# Altium schematic sheet MCU.SchDoc: QUTMS Shutdown V2.1 - MCU
size A4; Author: Jonn Dillon; Organization: QUT Motorsport; Address1: O-120; Address2: O Block; Address3: QUT Gardens Point; Address4: Brisbane, 4000; DocumentNumber: 2; Revision: 2; SheetNumber: 2; SheetTotal: 4
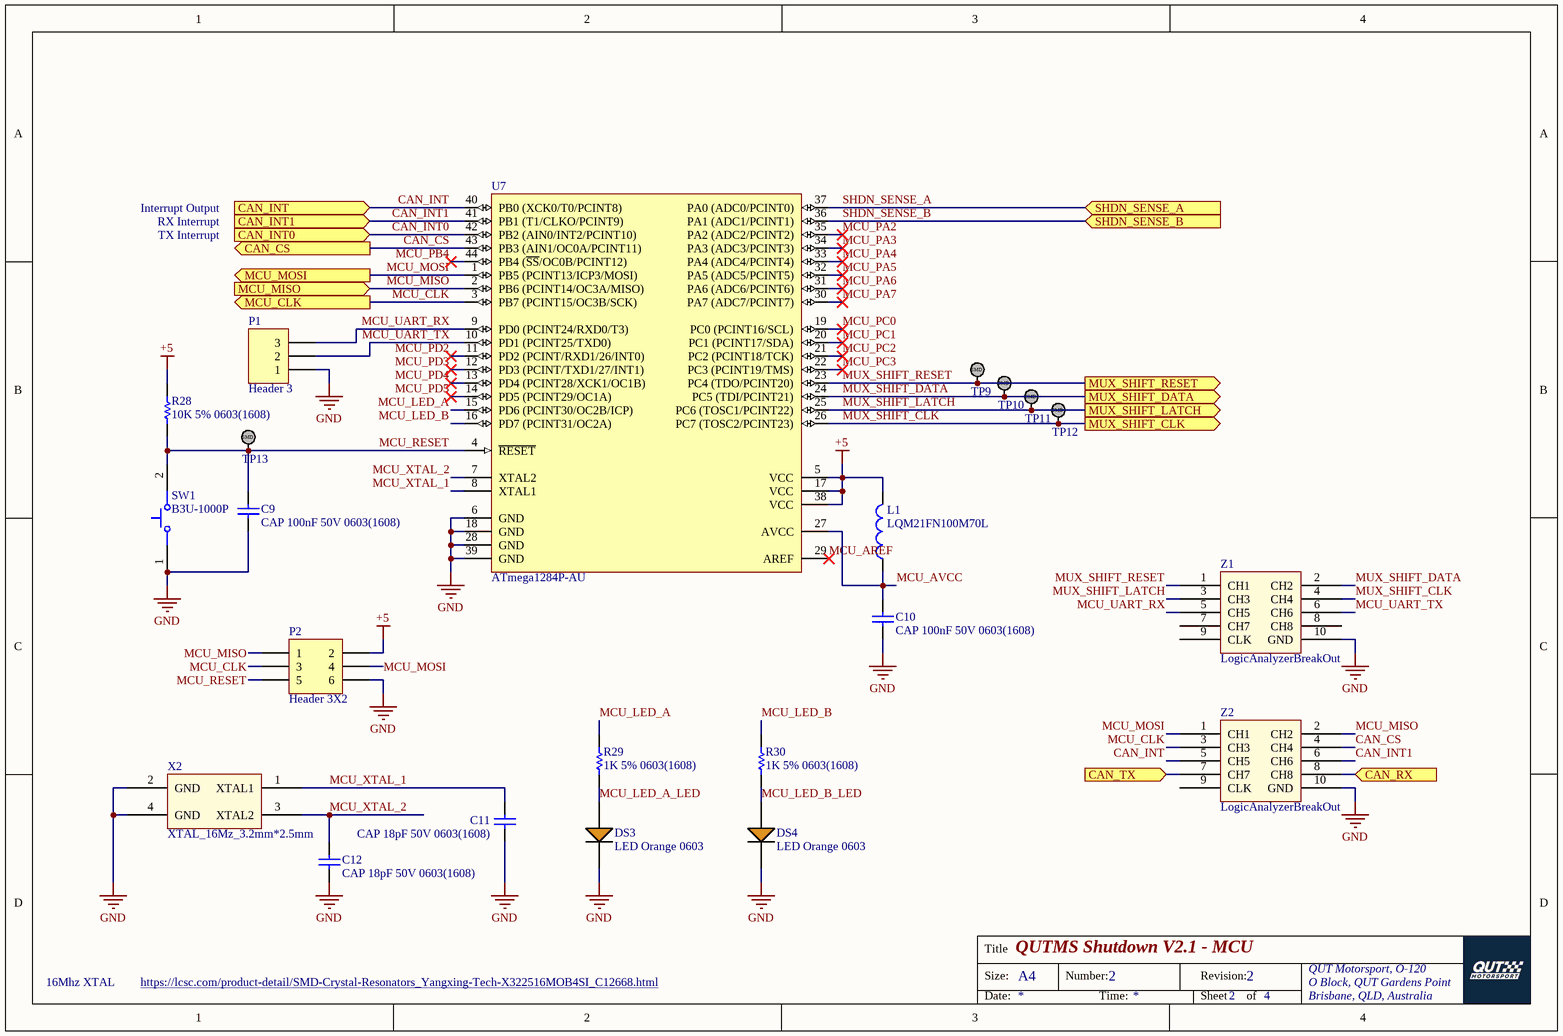
[diagram p0: MCU.SchDoc]

## Parts
C9  CAP 100nF 50V 0603(1608)  [CAPC0603(1608)100_L]
C10  CAP 100nF 50V 0603(1608)  [CAPC0603(1608)100_L]
C11  CAP 18pF 50V 0603(1608)  [CAPC0603(1608)100_L]
C12  CAP 18pF 50V 0603(1608)  [CAPC0603(1608)100_L]
DS3  LED Orange 0603  [LED ORANGE 0603]
DS4  LED Orange 0603  [LED ORANGE 0603]
L1  LQM21FN100M70L  [MURA-IND0805_L]
P1  Header 3  [HDR1X3]
P2  Header 3X2  [HDR2X3]
R28  10K 5% 0603(1608)  [RESC0603(1608)_N]
R29  1K 5% 0603(1608)  [RESC0603(1608)_L]
R30  1K 5% 0603(1608)  [RESC0603(1608)_L]
SW1  B3U-1000P  [OMRON-B3U-1000_V]
TP9  TestPoint_SMD  [TestPointSMD]  (value not drawn)
TP10  TestPoint_SMD  [TestPointSMD]  (value not drawn)
TP11  TestPoint_SMD  [TestPointSMD]  (value not drawn)
TP12  TestPoint_SMD  [TestPointSMD]  (value not drawn)
TP13  TestPoint_SMD  [TestPointSMD]  (value not drawn)
U7  ATmega1284P-AU  [44A_N]
X2  XTAL_16Mz_3.2mm*2.5mm  [3.2mm*2.5mm]
Z1  LogicAnalyzerBreakOut  [LogicAnalyzer]
Z2  LogicAnalyzerBreakOut  [LogicAnalyzer]

## Ports
CAN_CS (out), CAN_INT0 (in), CAN_INT1 (in), CAN_INT (in), CAN_RX (in), CAN_TX (in), MCU_CLK (out), MCU_MISO (in), MCU_MOSI (out), MUX_SHIFT_CLK (out), MUX_SHIFT_DATA (out), MUX_SHIFT_LATCH (out), MUX_SHIFT_RESET (out), SHDN_SENSE_A (in), SHDN_SENSE_B (in)

## Nets
+5: L1.2 P2.2 R28.2 U7.5(VCC) U7.17(VCC) U7.38(VCC)
GND: C9.2 C10.2 C11.1 C12.1 DS3.2(C) DS4.2(C) P1.1 P2.6 SW1.1 U7.6(GND) U7.18(GND) U7.28(GND) U7.39(GND) X2.2(GND) X2.4(GND) Z1.10(GND) Z2.10(GND)
CAN_CS: U7.43(PB3_(AIN1/OC0A/PCINT11)) Z2.4(CH4) ; port CAN_CS
CAN_INT: U7.40(PB0_(XCK0/T0/PCINT8)) Z2.5(CH5) ; port CAN_INT
CAN_INT0: U7.42(PB2_(AIN0/INT2/PCINT10)) ; port CAN_INT0
CAN_INT1: U7.41(PB1_(T1/CLKO/PCINT9)) Z2.6(CH6) ; port CAN_INT1
CAN_RX: Z2.8(CH8) ; port CAN_RX
CAN_TX: Z2.7(CH7) ; port CAN_TX
MCU_AREF: U7.29(AREF)
MCU_AVCC: C10.1 L1.1 U7.27(AVCC)
MCU_CLK: P2.3 U7.3(PB7_(PCINT15/OC3B/SCK)) Z2.3(CH3) ; port MCU_CLK
MCU_LED_A: R29.2 U7.15(PD6_(PCINT30/OC2B/ICP))
MCU_LED_A_LED: DS3.1(A) R29.1
MCU_LED_B: R30.2 U7.16(PD7_(PCINT31/OC2A))
MCU_LED_B_LED: DS4.1(A) R30.1
MCU_MISO: P2.1 U7.2(PB6_(PCINT14/OC3A/MISO)) Z2.2(CH2) ; port MCU_MISO
MCU_MOSI: P2.4 U7.1(PB5_(PCINT13/ICP3/MOSI)) Z2.1(CH1) ; port MCU_MOSI
MCU_PA2: U7.35(PA2_(ADC2/PCINT2))
MCU_PA3: U7.34(PA3_(ADC3/PCINT3))
MCU_PA4: U7.33(PA4_(ADC4/PCINT4))
MCU_PA5: U7.32(PA5_(ADC5/PCINT5))
MCU_PA6: U7.31(PA6_(ADC6/PCINT6))
MCU_PA7: U7.30(PA7_(ADC7/PCINT7))
MCU_PB4: U7.44(PB4_(~{SS}/OC0B/PCINT12))
MCU_PC0: U7.19(PC0_(PCINT16/SCL))
MCU_PC1: U7.20(PC1_(PCINT17/SDA))
MCU_PC2: U7.21(PC2_(PCINT18/TCK))
MCU_PC3: U7.22(PC3_(PCINT19/TMS))
MCU_PD2: U7.11(PD2_(PCINT/RXD1/26/INT0))
MCU_PD3: U7.12(PD3_(PCINT/TXD1/27/INT1))
MCU_PD4: U7.13(PD4_(PCINT28/XCK1/OC1B))
MCU_PD5: U7.14(PD5_(PCINT29/OC1A))
MCU_RESET: C9.1 P2.5 R28.1 SW1.2 TP13.1 U7.4(~{RESET})
MCU_UART_RX: P1.3 U7.9(PD0_(PCINT24/RXD0/T3)) Z1.5(CH5)
MCU_UART_TX: P1.2 U7.10(PD1_(PCINT25/TXD0)) Z1.6(CH6)
MCU_XTAL_1: C11.2 U7.8(XTAL1) X2.1(XTAL1)
MCU_XTAL_2: C12.2 U7.7(XTAL2) X2.3(XTAL2)
MUX_SHIFT_CLK: TP12.1 U7.26(PC7_(TOSC2/PCINT23)) Z1.4(CH4) ; port MUX_SHIFT_CLK
MUX_SHIFT_DATA: TP10.1 U7.24(PC5_(TDI/PCINT21)) Z1.2(CH2) ; port MUX_SHIFT_DATA
MUX_SHIFT_LATCH: TP11.1 U7.25(PC6_(TOSC1/PCINT22)) Z1.3(CH3) ; port MUX_SHIFT_LATCH
MUX_SHIFT_RESET: TP9.1 U7.23(PC4_(TDO/PCINT20)) Z1.1(CH1) ; port MUX_SHIFT_RESET
SHDN_SENSE_A: U7.37(PA0_(ADC0/PCINT0)) ; port SHDN_SENSE_A
SHDN_SENSE_B: U7.36(PA1_(ADC1/PCINT1)) ; port SHDN_SENSE_B

Not connected (* = marked no-connect by the designer): Z1 7(CH7) 8(CH8) 9(CLK); Z2 9(CLK)

## Notes on the sheet
- TX Interrupt
- RX Interrupt
- Interrupt Output
- 16Mhz XTAL
- https://lcsc.com/product-detail/SMD-Crystal-Resonators_Yangxing-Tech-X322516MOB4SI_C12668.html
- Title
- Size:
- A4
- Number:
- Revision:
- QUT Motorsport, O-120
- O Block, QUT Gardens Point
- Date:
- Time:
- Sheet
- of
- Brisbane, QLD, Australia
- (in symbol TestPoint_SMD) SMD

## Library data of the parts
C9 C10 = CMP-1035-02591-1: CAP 100nF 50V ±5% 0603 (1608 Metric) Thickness 1mm SMD; Tolerance: Â±5%; Case-Metric: 1608; Case-EIA: 0603; Rated Voltage: 50 V; Max Thickness: 1 mm; Technology: SMT; Value: 100nF
C11 C12 = CMP-1035-00748-1: CAP 18pF 50V ±1% 0603 (1608 Metric) Thickness 1mm SMD; Case-EIA: 0603; Case-Metric: 1608; Tolerance: Â±1%; Max Thickness: 1 mm; Value: 18pF; Rated Voltage: 50 V; Technology: SMT
L1 = CMP-2000-06587-1: Fixed Inductor, 10 uH, +/-20%, -55 to 125 degC, 2-Pin SMD (0805), RoHS, Tape and Reel; Manufacturer: Murata; Tolerance (%): 20%; DC Resistance: 0.6; Inductance-Nom: 10H; Rated Current-Max: 100mA; Package Reference: IND0805; Case Size/Dimension: 0805; Manufacturer URL: http://www.murata.com/; Package Description: 2-Pin Surface Mount Device, Body 2 x 1.25 mm; Datasheet URL: http://psearch.en.murata.com/inductor/product/LQM21FN100M70%23.pdf; Mounting Technology: SurfaceMount; Datasheet Version: 05/2016
P1 = Header 3: Header, 3-Pin; LatestRevisionDate: 17-Jul-2002; LatestRevisionNote: Re-released for DXP Platform.; Publisher: Altium Limited
P2 = Header 3X2: Header, 3-Pin, Dual row; LatestRevisionDate: 17-Jul-2002; LatestRevisionNote: Re-released for DXP Platform.; Publisher: Altium Limited
R28 = CMP-1012-00098-1: 10K 0.1W 5% 0603 (1608 Metric)  SMD; Case-EIA: 0603; Value: 10000.00 Ohm; Case-Metric: 1608; Technology: SMT; Tolerance: 5 %; Power: 0.1 W
R29 R30 = CMP-1012-00074-1: 1K 0.1W 5% 0603 (1608 Metric)  SMD; Case-EIA: 0603; Case-Metric: 1608; Value: 1000.00 Ohm; Technology: SMT; Tolerance: 5 %; Power: 0.1 W
SW1 = CMP-2100-03586-1: Ultra-Small Tactile Switch, 0.05 A, 12 V, -25 to 70 degC, 2-Pin SMD, RoHS, Tape and Reel; Manufacturer: Omron Electronic Components; Operating Force: 1.5N; Current Rating: 50mA; Voltage Rating (DC): 12V; Electrical Life: 200000Cycles; Actuator Length: 0.4mm; Insulation Resistance: 100MOhm; Switch Travel: 0.15mm; Throw Configuration: SPST; Illumination Type: Illuminated; Width: 3mm; Weight: 0.022g; Datasheet Version: 42005.0; Datasheet URL: http://www.omron.com/ecb/products/pdf/en-b3u.pdf; Height: 1.2mm; Package Quantity: 1; REACH SVHC: Unknown; Contact Current Rating: 50mA; Contact Material: Silver; Max Current Rating: 50mA; Package Reference: B3U-1000; Termination: SMD/SMT; Packaging: TapeandReel; Manufacturer URL: http://www.omron.com/; RoHSCompliant: true; Mount: SurfaceMount; Length: 4mm; Min Operating Temperature: -25degC; Depth: 2.5mm; Lead Free: LeadFree; Case/Package: SMD/SMT; Package Description: 2-Pin Surface Mount Device, Body 3 x 2.5 mm; Max Operating Temperature: 70degC; Orientation: Straight
U7 = CMP-0095-00577-1: 8-bit AVR Microcontroller, 128KB Flash, 4KB EEPROM, 16KB SRAM, 44-pin TQFP, Industrial Grade (-40°C to 85°C); PackageReference: 44A; Code_JEDEC: MS-026-ACB; ComponentLink3Description: ATmega164A/164PA/324A/324PA/644A/644PA/1284/1284P Summary; DatasheetVersion: revC, Jun-2011; PackageDescription: 44-Pin Plastic Thin Profile Quad Flat Pack, 10 x 10 x 1.0 mm Body, 0.8 mm Pitch (TQFP); ComponentLink3URL: http://www.atmel.com/dyn/resources/prod_documents/8272S.pdf; ComponentLink1URL: http://www.atmel.com/; ComponentLink1Description: Manufacturer URL; ComponentLink2Description: ATmega164A/164PA/324A/324PA/644A/644PA/1284/1284P Datasheet; ComponentLink2URL: http://www.atmel.com/dyn/resources/prod_documents/doc8272.pdf; PackageVersion: revC, Oct-2010
Z1 Z2 = LogicAnalyer
  Z1: ComponentLink1Description: LCSC; ComponentLink1URL: https://lcsc.com/product-detail/IDC-Connectors_BOOMELE-Boom-Precision-Elec-C5665_C5665.html
X2 = XTAL_16Mz_3.2mm*2.5mm: ComponentLink1Description: LCSC; ComponentLink1URL: https://lcsc.com/product-detail/SMD-Crystal-Resonators_Yangxing-Tech-X322516MOB4SI_C12668.html